# Altium schematic sheet CANBus.SchDoc
size A; SheetNumber: 7; SheetTotal: 11
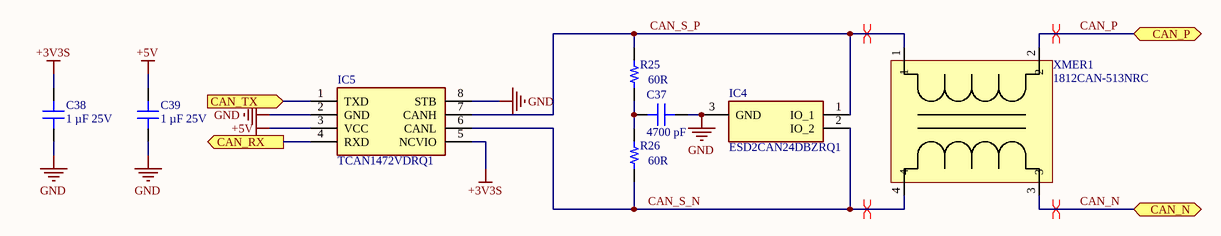
[diagram p0: CANBus.SchDoc]

## Parts
C37  4700 pF  [CAP 0603_1608]
C38  Capacitance: 1 µF 25V  [CAP 0402_1005]  (hidden comment: 1 µF)
C39  Capacitance: 1 µF 25V  [CAP 0402_1005]  (hidden comment: 1 µF)
IC4  ESD2CAN24DBZRQ1  [SOT95P237X112-3N]
IC5  TCAN1472VDRQ1  [SOIC127P600X175-8N]
R25  60R  [RES 0603_1608]
R26  60R  [RES 0603_1608]
XMER1  1812CAN-513NRC  [XMER_1812CAN-513NRC_COC]

## Ports
CAN_N (bidir), CAN_P (bidir), CAN_RX (out), CAN_TX (in)

## Nets
+3V3S: C38.2 IC5.5(NCVIO)
+5V: C39.2 IC5.3(VCC)
GND: C37.2 C38.1 C39.1 IC4.3(GND) IC5.2(GND) IC5.8(STB)
CAN_N: XMER1.3 ; port CAN_N
CAN_P: XMER1.2 ; port CAN_P
CAN_RX: IC5.4(RXD) ; port CAN_RX
CAN_S_N: IC4.2(IO_2) IC5.6(CANL) R26.1 XMER1.4
CAN_S_P: IC4.1(IO_1) IC5.7(CANH) R25.2 XMER1.1
CAN_TX: IC5.1(TXD) ; port CAN_TX
NetC37_1: C37.1 R25.1 R26.2

## Layout directives
differential pair: CAN_N, CAN_P, CAN_S_N, CAN_S_P

## Library data of the parts
C37 = C0603C472K4RECAUTO: CAP CER 0603 4.7NF 16V X7R 10%; manufacturer: KEMET; Part Number: C0603C472K4RECAUTO; value: 4700 pF; Applications: Automotive, ESD Protection; Capacitance: 4700 pF; componentlink1description: Datasheet; componentlink1url: https://api.kemet.com/component-edge/download/datasheet/C0603C472K4RECAUTO.pdf; componentlink2description: DigiKey Link; componentlink2url: https://www.digikey.com/en/products/detail/kemet/C0603C472K4RECAUTO/8640473; Device Package: 0603 (1608 Metric); lastupdated: 2/9/2024 8:10:07 PM; Lifecycle Status: Active; Minimum Order: 1; Mounting Type: Surface Mount, MLCC; Operating Temperature: -55°C ~ 125°C; Package / Case: 0603 (1608 Metric); packaging: TapeAndReel; partid: 17340; Part Status: Active; price: 0.01; Ratings: AEC-Q200; series: ESD SMD Auto X7R; Size / Dimension: 0.063" L x 0.031" W (1.60mm x 0.80mm); Supplier 1: DigiKey; Supplier Part Number 1: 399-17879-1-ND; Temperature Coefficient: X7R; Thickness (Max): 0.034" (0.87mm); Tolerance: ±10%; Voltage - Rated: 16V
C38 C39 = LMK105BJ105KPLF: CAP CER 1UF 10V X5R 0402; manufacturer: Taiyo Yuden; Tolerance: ±10%; Part Number: LMK105BJ105KPLF; Applications: SMPS Filtering; componentlink1description: Datasheet; componentlink1url: https://ds.yuden.co.jp/TYCOMPAS/ut/detail?pn=LMK105BJ105KPLF &u=M; componentlink2description: DigiKey Link; componentlink2url: https://www.digikey.com/en/products/detail/taiyo-yuden/LMK105BJ105KPLF/7403744; Device Package: 0402 (1005 Metric); lastupdated: 2/9/2024 8:04:36 PM; Lifecycle Status: Active; Minimum Order: 1; Mounting Type: Surface Mount, MLCC; Operating Temperature: -55°C ~ 85°C; Package / Case: 0402 (1005 Metric); packaging: TapeAndReel; partid: 2328; Part Status: Active; price: 0.02; series: M; Size / Dimension: 0.039" L x 0.020" W (1.00mm x 0.50mm); Supplier 1: DigiKey; Supplier Part Number 1: 587-6274-1-ND; Temperature Coefficient: X5R; Thickness (Max): 0.026" (0.65mm); value: 1 µF; Voltage - Rated: 10V
IC4 = ESD2CAN24DBZRQ1: Integrated Circuit; Manufacturer_Name: Texas Instruments; Datasheet Link: https://www.ti.com/lit/ds/symlink/esd2can24-q1.pdf?ts=1669637432096&ref_url=https%253A%252F%252Fwww.ti.com%252Fproduct%252FESD2CAN24-Q1; Height: 1.12mm; Manufacturer_Part_Number: ESD2CAN24DBZRQ1; Mouser Part Number: 595-ESD2CAN24DBZRQ1; Mouser Price/Stock: https://www.mouser.co.uk/ProductDetail/Texas-Instruments/ESD2CAN24DBZRQ1?qs=Y0Uzf4wQF3knJz9mU6BNuw%3D%3D; Arrow Part Number: ESD2CAN24DBZRQ1; Arrow Price/Stock: https://www.arrow.com/en/products/esd2can24dbzrq1/texas-instruments?utm_currency=USD&region=nac
IC5 = TCAN1472VDRQ1: Integrated Circuit; Manufacturer_Name: Texas Instruments; Datasheet Link: https://www.ti.com/lit/ds/symlink/tcan1472-q1.pdf; Height: 1.75mm; Manufacturer_Part_Number: TCAN1472VDRQ1; Mouser Part Number: 595-TCAN1472VDRQ1; Mouser Price/Stock: https://www.mouser.co.uk/ProductDetail/Texas-Instruments/TCAN1472VDRQ1?qs=7%2F6SraaimPTs1XgFSA%2FENg%3D%3D
R25 R26 = RMCF0603JT560R: RES 560 OHM 5% 1/10W 0603; Manufacturer: Stackpole Electronics Inc; Value: 560 Ohms; Power (Watts): 0.1W, 1/10W; Temperature Coefficient: ±200ppm/°C; Part Number: RMCF0603JT560R; ComponentLink1Description: Datasheet; ComponentLink1URL: https://www.seielect.com/catalog/sei-rmcf_rmcp.pdf; ComponentLink2Description: DigiKey Link; ComponentLink2URL: https://www.digikey.com/en/products/detail/stackpole-electronics-inc/RMCF0603JT560R/1712305; Composition: Thick Film; Device Package: 0603 (1608 Metric); Features: Automotive AEC-Q200; Height - Seated (Max): 0.022" (0.55mm); LastUpdated: 2/9/2024 8:43:32 PM; Lifecycle Status: Active; Minimum Order: 1; Number of Terminations: 2; Operating Temperature: -55°C ~ 155°C; Package / Case: 0603 (1608 Metric); Packaging: CutTape; PartId: 5967; Part Status: Active; Price: 0.01; Ratings: AEC-Q200; Resistance: 560 Ohms; Series: RMCF; Size / Dimension: 0.061" L x 0.031" W (1.55mm x 0.80mm); Supplier 1: DigiKey; Supplier Part Number 1: RMCF0603JT560RCT-ND; Supplier Device Package: 0603; Tolerance: ±5%
XMER1 = 1812CAN-513NRC: No Description Available; Mfr_Name: Coilcraft; RefDes: RefDes; Type: Type